# Altium schematic sheet STM32.SchDoc
size A3; SheetNumber: 6; SheetTotal: 6
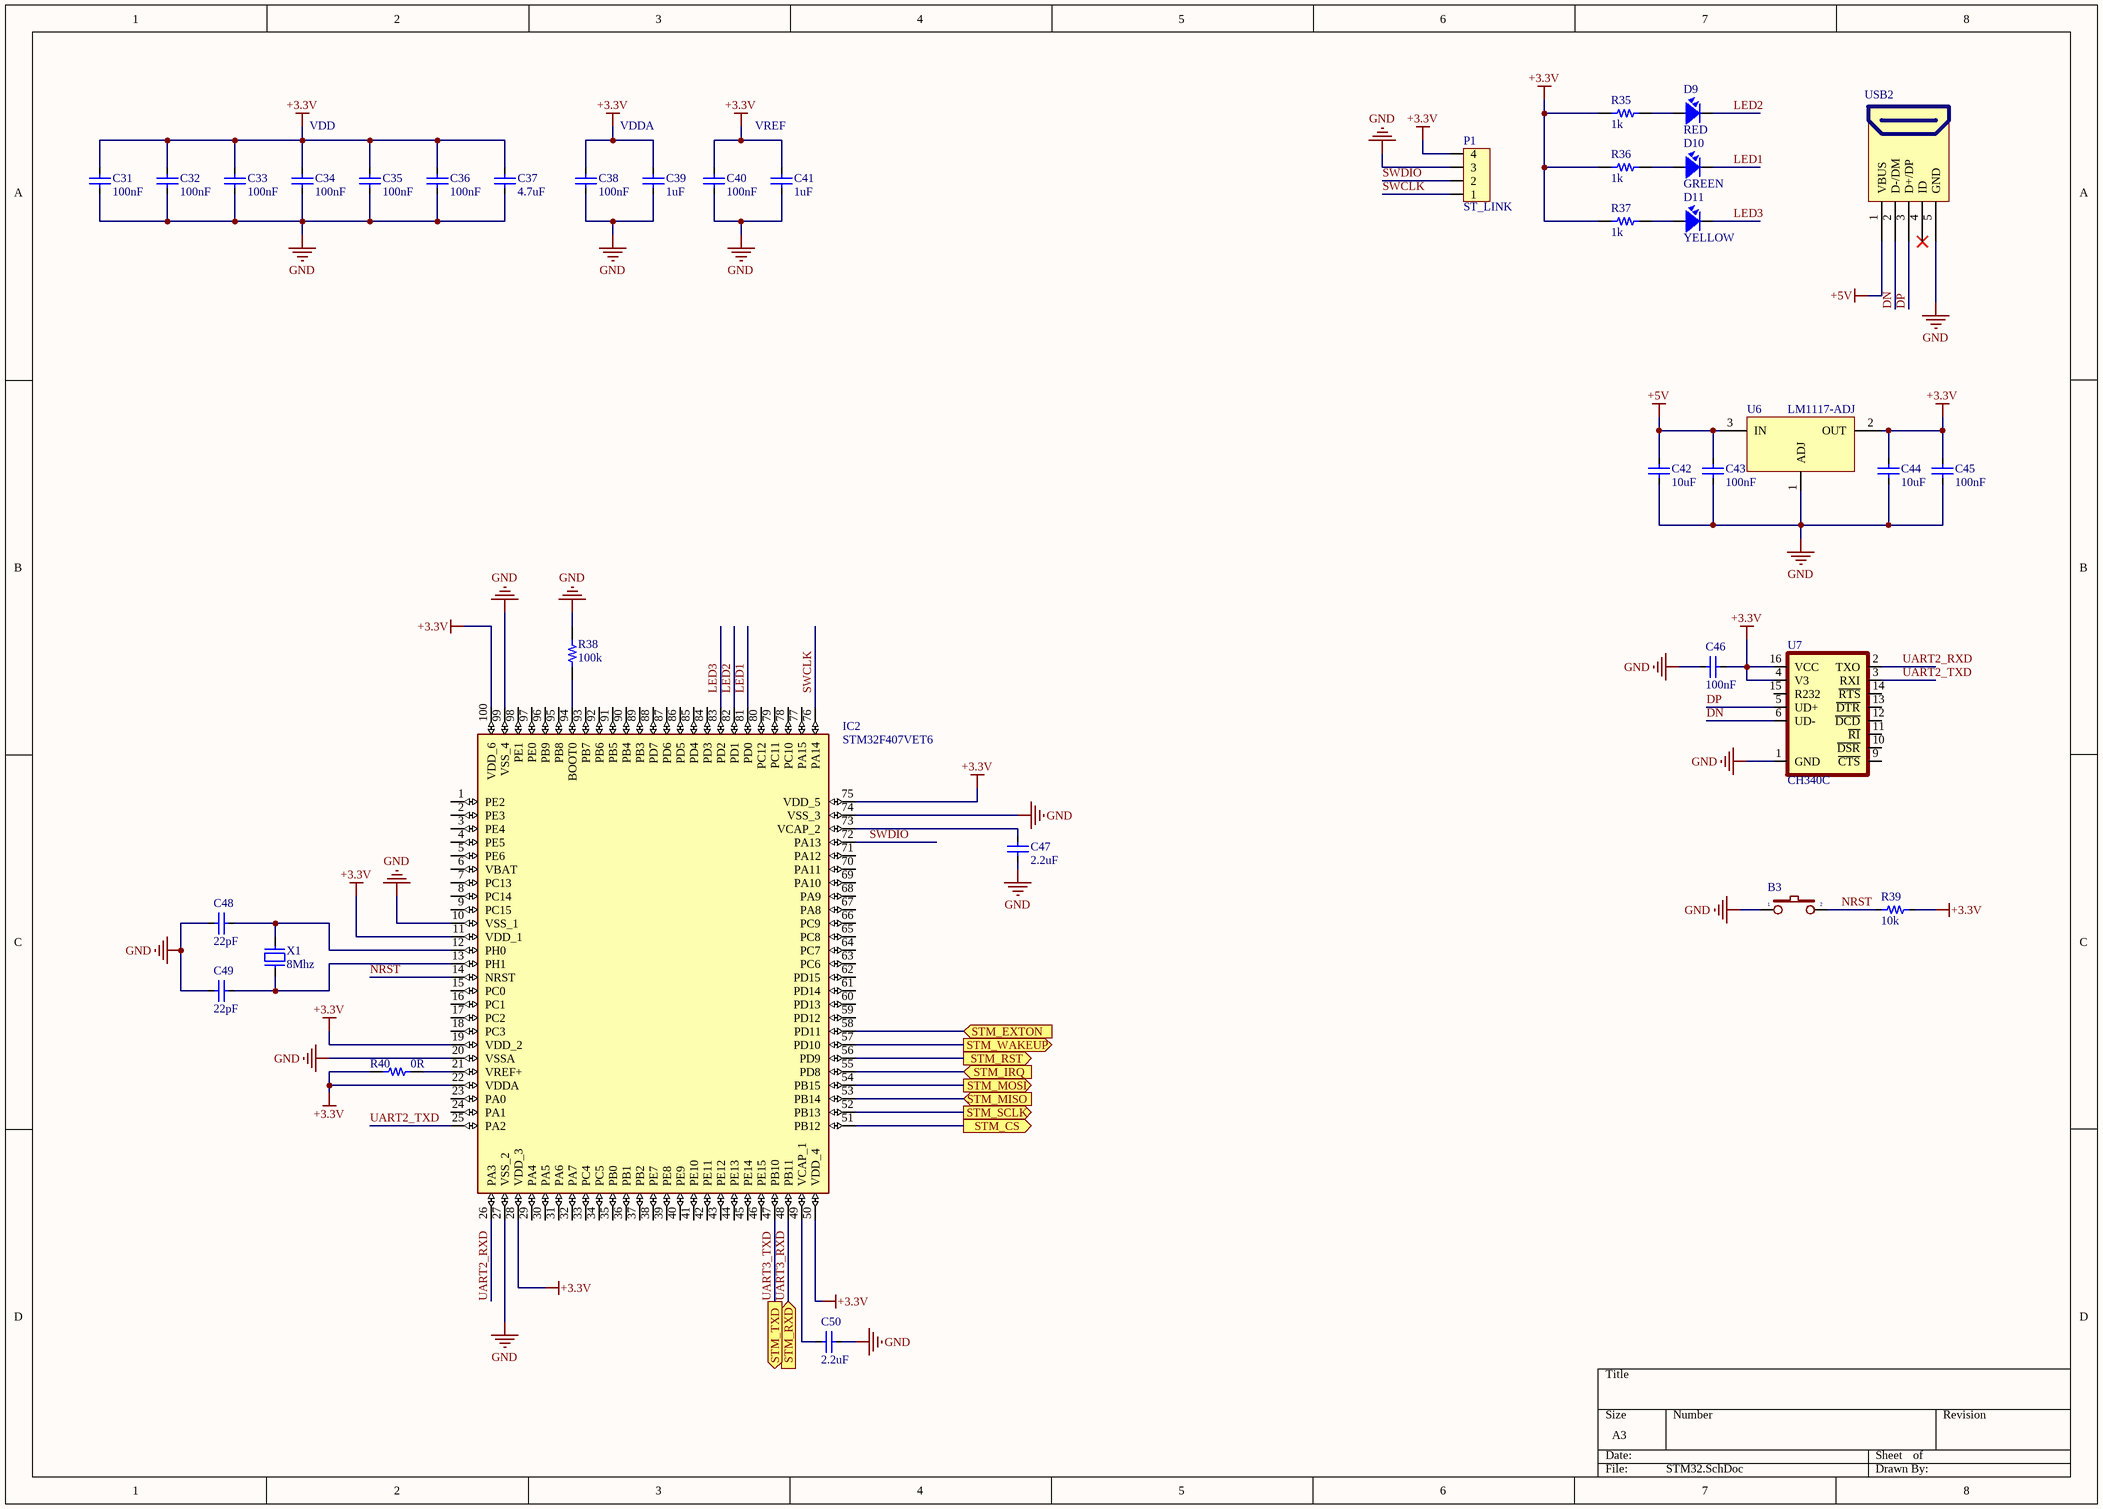
[diagram p0: STM32.SchDoc]

## Parts
B3  Button 3x4x2.5  [Button 3x4x2.5]  (value not drawn)
C31  100nF  [CAP_0603]
C32  100nF  [CAP_0603]
C33  100nF  [CAP_0603]
C34  100nF  [CAP_0603]
C35  100nF  [CAP_0603]
C36  100nF  [CAP_0603]
C37  4.7uF  [CAP_0603]
C38  100nF  [CAP_0603]
C39  1uF  [CAP_0603]
C40  100nF  [CAP_0603]
C41  1uF  [CAP_0603]
C42  10uF  [CAP_0603]
C43  100nF  [CAP_0603]
C44  10uF  [CAP_0603]
C45  100nF  [CAP_0603]
C46  100nF  [CAP_0603]
C47  2.2uF  [CAP_0603]
C48  22pF  [CAP_0603]
C49  22pF  [CAP_0603]
C50  2.2uF  [CAP_0603]
D9  RED  [LED-0603-Red]
D10  GREEN  [LED-0603-Green]
D11  YELLOW  [LED-0603-Red]
IC2  STM32F407VET6  [STM32F407VET6]
P1  ST_LINK  [HEADER4P-1.25]
R35  1k  [RES-SMD-0603]
R36  1k  [RES-SMD-0603]
R37  1k  [RES-SMD-0603]
R38  100k  [RES-SMD-0603]
R39  10k  [RES-SMD-0603]
R40  0R  [RES-SMD-0603]
U6  LM1117-ADJ  [LM1117-SOP]
U7  CH340C  [SO16]
USB2  USB Micro 5p DIP  [USB Micro 5p DIP]  (value not drawn)
X1  8Mhz  [XTAL 5032 SMD]

## Ports
STM_CS (out), STM_EXTON (in), STM_IRQ (in), STM_MISO (in), STM_MOSI (out), STM_RST (out), STM_RXD (in), STM_SCLK (out), STM_TXD (out), STM_WAKEUP (out)

## Nets
+3.3V: C31.2 C32.2 C33.2 C34.2 C35.2 C36.2 C37.2 C38.2 C39.2 C40.2 C41.2 C44.1 C45.1 C46.1 IC2.11(VDD_1) IC2.19(VDD_2) IC2.22(VDDA) IC2.28(VDD_3) IC2.50(VDD_4) IC2.75(VDD_5) IC2.100(VDD_6) P1.4 R35.2 R36.2 R37.2 R39.1 R40.2 U6.2(OUT) U7.4(V3) U7.16(VCC)
+5V: C42.1 C43.1 U6.3(IN) USB2.1(VBUS)
GND: B3.1 C31.1 C32.1 C33.1 C34.1 C35.1 C36.1 C37.1 C38.1 C39.1 C40.1 C41.1 C42.2 C43.2 C44.2 C45.2 C46.2 C47.2 C48.1 C49.1 C50.2 IC2.10(VSS_1) IC2.20(VSSA) IC2.27(VSS_2) IC2.74(VSS_3) IC2.99(VSS_4) P1.3 R38.1 U6.1(ADJ) U7.1(GND) USB2.5(GND)
DN: U7.6(UD-) USB2.2(D-/DM)
DP: U7.5(UD+) USB2.3(D+/DP)
LED1: D10.2 IC2.81(PD0)
LED2: D9.2 IC2.82(PD1)
LED3: D11.2 IC2.83(PD2)
NRST: B3.2 IC2.14(NRST) R39.2
STM_CS: IC2.51(PB12) ; port STM_CS
STM_EXTON: IC2.58(PD11) ; port STM_EXTON
STM_IRQ: IC2.55(PD8) ; port STM_IRQ
STM_MISO: IC2.53(PB14) ; port STM_MISO
STM_MOSI: IC2.54(PB15) ; port STM_MOSI
STM_RST: IC2.56(PD9) ; port STM_RST
STM_SCLK: IC2.52(PB13) ; port STM_SCLK
STM_WAKEUP: IC2.57(PD10) ; port STM_WAKEUP
SWCLK: IC2.76(PA14) P1.1
SWDIO: IC2.72(PA13) P1.2
UART2_RXD: IC2.26(PA3) U7.2(TXO)
UART2_TXD: IC2.25(PA2) U7.3(RXI)
UART3_RXD: IC2.48(PB11) ; port STM_RXD
UART3_TXD: IC2.47(PB10) ; port STM_TXD
NetC47_1: C47.1 IC2.73(VCAP_2)
NetC48_2: C48.2 IC2.12(PH0) X1.1
NetC49_2: C49.2 IC2.13(PH1) X1.2
NetC50_1: C50.1 IC2.49(VCAP_1)
NetD9_1: D9.1 R35.1
NetD10_1: D10.1 R36.1
NetD11_1: D11.1 R37.1
NetIC2_21: IC2.21(VREF+) R40.1
NetIC2_94: IC2.94(BOOT0) R38.2

Not connected (* = marked no-connect by the designer): IC2 1(PE2) 2(PE3) 3(PE4) 4(PE5) 5(PE6) 6(VBAT) 7(PC13) 8(PC14) 9(PC15) 15(PC0) 16(PC1) 17(PC2) 18(PC3) 23(PA0) 24(PA1) 29(PA4) 30(PA5) 31(PA6) 32(PA7) 33(PC4) 34(PC5) 35(PB0) 36(PB1) 37(PB2) 38(PE7) 39(PE8) 40(PE9) 41(PE10) 42(PE11) 43(PE12) 44(PE13) 45(PE14) 46(PE15) 59(PD12) 60(PD13) 61(PD14) 62(PD15) 63(PC6) 64(PC7) 65(PC8) 66(PC9) 67(PA8) 68(PA9) 69(PA10) 70(PA11) 71(PA12) 77(PA15) 78(PC10) 79(PC11) 80(PC12) 84(PD3) 85(PD4) 86(PD5) 87(PD6) 88(PD7) 89(PB3) 90(PB4) 91(PB5) 92(PB6) 93(PB7) 95(PB8) 96(PB9) 97(PE0) 98(PE1); U7 9(~{CTS}) 10(~{DSR}) 11(~{RI}) 12(~{DCD}) 13(~{DTR}) 14(~{RTS}) 15(R232); USB2 4(ID)*

## Notes on the sheet
- VDD
- VDDA
- VREF

## Library data of the parts
C31-C50 = CapSMD: Capacitor; Value: 33p; Published: 8-Jun-2000; LatestRevisionDate: 17-Jul-2002; LatestRevisionNote: Re-released for DXP Platform.; PackageReference: RAD-0.3; Publisher: Altium Limited
D9-D11 = LED: LED Single colour Green and Red; Value: LED 3 ly Single Colour
P1 = Header4: Header IDC, 4 x 1 Pin Vertical 2.54mm Pitch (Non-Boxed, Male); Manufacturer: W¨¹rth Elektronik eiSos GmbH; partNo: 613002143121; ComponentLink1 Description: Manufacturer; ComponentLink2 Description: Datasheet; NoPins: 02; Created Date: 29 March 2013; ComponentLink1URL: http://www.we-online.com; ComponentLink2URL: http://katalog.we-online.de/em/datasheet/6130xx143121.pdf; Created by: Karrer Zheng
R35-R40 = Resistor - SMD: Resistor; Manufacturer: Generic Components; Class: Passive; Published: 08/06/2000; Publisher: Altium Hobart Technology Centre
U6 = LM1117-ADJ: 800mA Low-Dropout Linear Regulator; Creator: Nguyen Ba Bien; Website: http://group3i.net
U7 = CH340C: USB to serial chip CH340; MF: WCH; Package: Package; Check_prices: https://www.snapeda.com/parts/CH340C/WCH/view-part/5428851/?ref=eda; Value: *; Price: None; MP: CH340C; Availability: Unavailable; SnapEDA_Link: https://www.snapeda.com/parts/CH340C/WCH/view-part/5428851/?ref=snap
USB2 = USB Micro 5p DIP: USB Type B; Ten: MicroUSB MK5P DIP; Ma_Hang: MH005145
X1 = XT2: Crystal For all Crystal 2pin.; Value: 4Mhz